# Altium schematic sheet MotorDrivers.SchDoc
size A4
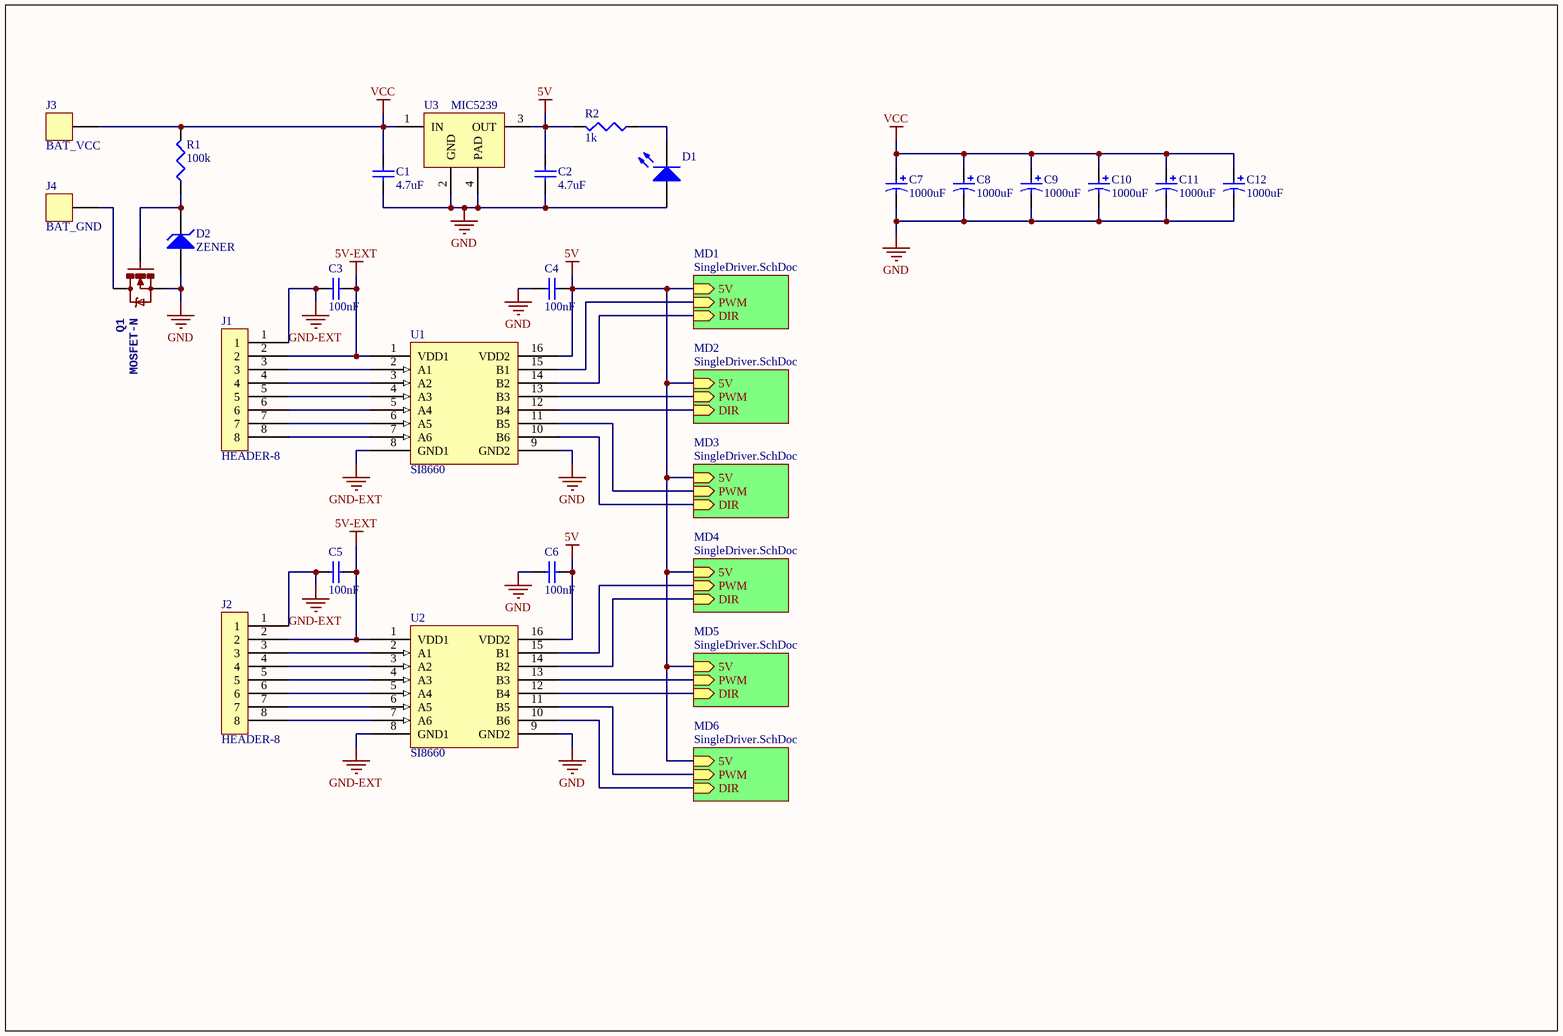
[diagram p0: MotorDrivers.SchDoc]

## Parts
C1  4.7uF  [C1206]
C2  4.7uF  [C1206]
C3  100nF  [1608[0603]]
C4  100nF  [1608[0603]]
C5  100nF  [1608[0603]]
C6  100nF  [1608[0603]]
C7  1000uF  [cap_radial_20]
C8  1000uF  [cap_radial_20]
C9  1000uF  [cap_radial_20]
C10  1000uF  [cap_radial_20]
C11  1000uF  [cap_radial_20]
C12  1000uF  [cap_radial_20]
D1  LED2  [1608[0603]]  (value not drawn)
D2  ZENER  [SODFL370X135-2N]
J1  HEADER-8  [MICRO-MATCH-8]
J2  HEADER-8  [MICRO-MATCH-8]
J3  BAT_VCC  [HIGH-POWER-VIA]
J4  BAT_GND  [HIGH-POWER-VIA]
Q1  MOSFET-N  [SOT669]
R1  100k  [J1-0603]
R2  1k  [J1-0603]
U1  SI8660  [SOIC16]
U2  SI8660  [SOIC16]
U3  MIC5239  [SOT230P700X180-4N]

## Sub-sheets
MD1 = SingleDriver.SchDoc: 5V (in), PWM (in), DIR (in)
MD2 = SingleDriver.SchDoc: 5V (in), PWM (in), DIR (in)
MD3 = SingleDriver.SchDoc: 5V (in), PWM (in), DIR (in)
MD4 = SingleDriver.SchDoc: 5V (in), PWM (in), DIR (in)
MD5 = SingleDriver.SchDoc: 5V (in), PWM (in), DIR (in)
MD6 = SingleDriver.SchDoc: 5V (in), PWM (in), DIR (in)

## Nets
5V: C2.2 C4.1 C6.1 R2.2 U1.16(VDD2) U2.16(VDD2) U3.3(OUT) ; sheet MD1/5V, sheet MD2/5V, sheet MD3/5V, sheet MD4/5V, sheet MD5/5V, sheet MD6/5V
5V-EXT: C3.1 C5.1 J1.2 J2.2 U1.1(VDD1) U2.1(VDD1)
GND: C1.1 C2.1 C4.2 C6.2 C7.1 C8.1 C9.1 C10.1 C11.1 C12.1 D1.1(A) D2.2 Q1.S U1.9(GND2) U2.9(GND2) U3.2(GND) U3.4(PAD)
GND-EXT: C3.2 C5.2 J1.1 J2.1 U1.8(GND1) U2.8(GND1)
VCC: C1.2 C7.2 C8.2 C9.2 C10.2 C11.2 C12.2 J3.1 R1.2 U3.1(IN)
NetD1_2: D1.2(K) R2.1
NetD2_1: D2.1 Q1.G R1.1
NetJ1_3: J1.3 U1.2(A1)
NetJ1_4: J1.4 U1.3(A2)
NetJ1_5: J1.5 U1.4(A3)
NetJ1_6: J1.6 U1.5(A4)
NetJ1_7: J1.7 U1.6(A5)
NetJ1_8: J1.8 U1.7(A6)
NetJ2_3: J2.3 U2.2(A1)
NetJ2_4: J2.4 U2.3(A2)
NetJ2_5: J2.5 U2.4(A3)
NetJ2_6: J2.6 U2.5(A4)
NetJ2_7: J2.7 U2.6(A5)
NetJ2_8: J2.8 U2.7(A6)
NetJ4_1: J4.1 Q1.D
NetU1_10: U1.10(B6) ; sheet MD3/DIR
NetU1_11: U1.11(B5) ; sheet MD3/PWM
NetU1_12: U1.12(B4) ; sheet MD2/DIR
NetU1_13: U1.13(B3) ; sheet MD2/PWM
NetU1_14: U1.14(B2) ; sheet MD1/DIR
NetU1_15: U1.15(B1) ; sheet MD1/PWM
NetU2_10: U2.10(B6) ; sheet MD6/DIR
NetU2_11: U2.11(B5) ; sheet MD6/PWM
NetU2_12: U2.12(B4) ; sheet MD5/DIR
NetU2_13: U2.13(B3) ; sheet MD5/PWM
NetU2_14: U2.14(B2) ; sheet MD4/DIR
NetU2_15: U2.15(B1) ; sheet MD4/PWM

## Library data of the parts
C1-C6 = Cap Semi: Capacitor (Semiconductor SIM Model); Value: 100pF; Published: 8-Jun-2000; LatestRevisionDate: 29-May-2009; LatestRevisionNote: IPC-7351 Footprint Added.; PackageReference: C1206; Publisher: Altium Limited; PackageDescription: Chip Capacitor
C7-C12 = cap_pol
D1 = LED2: Typical RED, GREEN, YELLOW, AMBER GaAs LED; Published: 8-Jun-2000; LatestRevisionDate: 17-Jul-2002; LatestRevisionNote: Re-released for DXP Platform.; PackageVersion: Feb-2002; PackageReference: 3.2X1.6X1.1; Publisher: Altium Limited; PackageDescription: SM LED; 2 Flat Leads
D2 = ZENER-DIODE
J3 J4 = HEADER-1
Q1 = MOSFET-N: PROD_ID: IC-08089
R1 = Res3: Resistor; Value: 1K; Published: 8-Jun-2000; LatestRevisionDate: 29-May-2009; LatestRevisionNote: IPC-7351 Footprint Added.; PackageReference: J1-0603; Publisher: Altium Limited; PackageDescription: Chip Resistor
R2 = Res3: Resistor; Published: 8-Jun-2000; LatestRevisionDate: 29-May-2009; LatestRevisionNote: IPC-7351 Footprint Added.; PackageReference: J1-0603; Publisher: Altium Limited; PackageDescription: Chip Resistor; Value: 1K